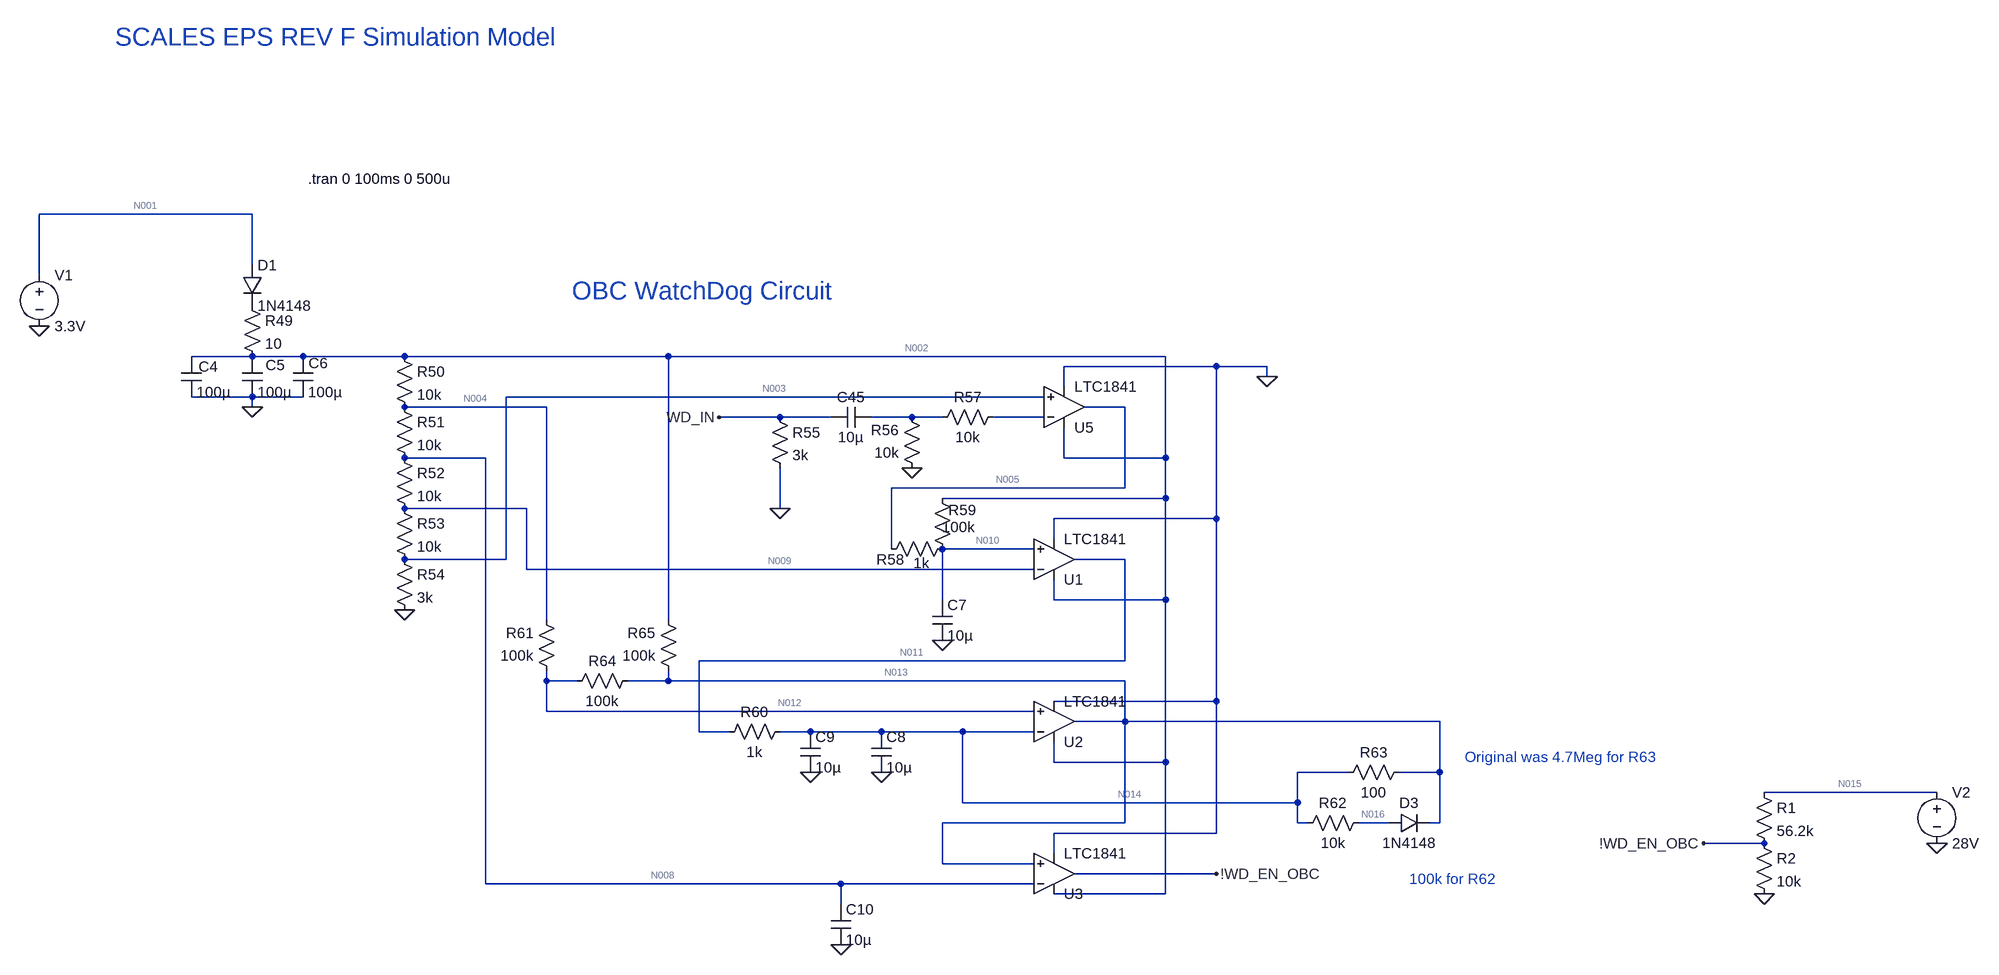
[diagram p0: schematic wd_sim.asc]
* wd_sim.asc
C4 N002 0 100µ
C5 N002 0 100µ
C6 N002 0 100µ
R49 P001 N002 10
D1 N001 P001 1N4148
R50 N002 N004 10k
R51 N004 N008 10k
R52 N008 N009 10k
R53 N009 N003 10k
R54 N003 0 3k
R57 N007 N006 10k
R56 0 N006 10k
C45 N006 WD_IN 10µ
R55 WD_IN 0 3k
C7 N010 0 10µ
R58 N010 N005 1k
R64 N013 N012 100k
R65 N013 N002 100k
R61 N012 N004 100k
C8 N014 0 10µ
C9 N014 0 10µ
R60 N014 N011 1k
R63 N013 N014 100
R62 N016 N014 10k
D3 N016 N013 1N4148
C10 N008 0 10µ
V1 N001 0 3.3V
R59 N010 N002 100k
V2 N015 0 28V
R1 N015 !WD_EN_OBC 56.2k
R2 !WD_EN_OBC 0 10k
* U5: LTC1841 (symbol Comparators\LTC1841 not available, pins judged from their places): In+=N003 In-=N007 V+=N002 V-=0 OUT=N005
* U1: LTC1841 (symbol Comparators\LTC1841 not available, pins judged from their places): In+=N010 In-=N009 V+=N002 V-=0 OUT=N011
* U2: LTC1841 (symbol Comparators\LTC1841 not available, pins judged from their places): In+=N012 In-=N014 V+=N002 V-=0 OUT=N013
* U3: LTC1841 (symbol Comparators\LTC1841 not available, pins judged from their places): In+=N013 In-=N008 V+=N002 V-=0 OUT=!WD_EN_OBC
.model D D
.lib standard.dio
* SCALES EPS REV F Simulation Model
* OBC WatchDog Circuit
.tran 0 100ms 0 500u
* Original was 4.7Meg for R63
* 100k for R62
.backanno
.end

* Results of the author's LTspice run, read from the files saved beside the schematic
* Operating Point, zero values left out:
*   V(n002) = 2.827 V
*   V(p001) = 2.827 V
*   V(n001) = 3.3 V
*   V(n004) = 2.154 V
*   V(n008) = 1.501 V
*   V(n009) = 848.5 mV
*   V(n003) = 195.8 mV
*   V(n010) = 2.827 V
*   V(n005) = 2.827 V
*   V(n013) = 1.754 V
*   V(n012) = 1.954 V
*   V(n014) = 1.754 V
*   V(n011) = 1.754 V
*   V(n016) = 1.754 V
*   V(n015) = 28 V
*   V(!wd_en_obc) = 4.23 V
*   I(D1) = 85.04 µA
*   I(R49) = 85.04 µA
*   I(R50) = 67.27 µA
*   I(R51) = 65.27 µA
*   I(R52) = 65.27 µA
*   I(R53) = 65.27 µA
*   I(R54) = 65.27 µA
*   I(R58) = 288.3 pA
*   I(R64) = -2 µA
*   I(R65) = -10.73 µA
*   I(R61) = -2 µA
*   I(R60) = 178.9 pA
*   I(R63) = 178.9 pA
*   I(R59) = -288.3 pA
*   I(R1) = 423 µA
*   I(R2) = 423 µA
*   I(V1) = -85.04 µA
*   I(V2) = -423 µA
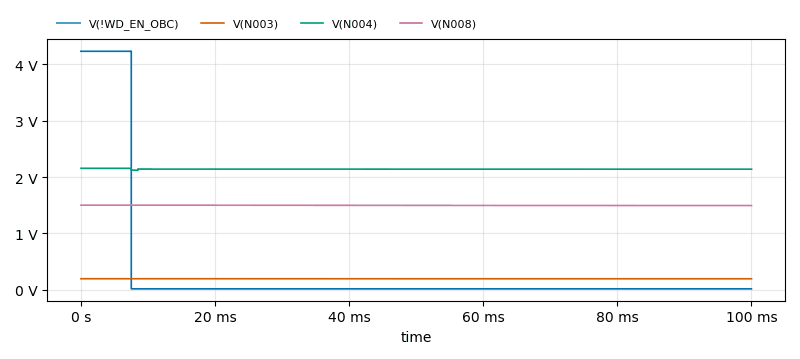
[diagram p1: Transient Analysis of wd_sim.asc, plotted from the saved traces]
* Transient Analysis, 1 run:
*   V(!WD_EN_OBC): min 16.64 mV, max 4.231 V, average 332.6 mV, rms 1.158 V, last 16.65 mV
*   V(N003): min 194.8 mV, max 195.8 mV, average 195.3 mV, rms 195.3 mV, last 194.8 mV
*   V(N004): min 2.119 V, max 2.154 V, average 2.14 V, rms 2.14 V, last 2.139 V
*   V(N008): min 1.494 V, max 1.501 V, average 1.497 V, rms 1.497 V, last 1.494 V